# EAGLE schematic MotorDriver (EAGLE 6.5.0)
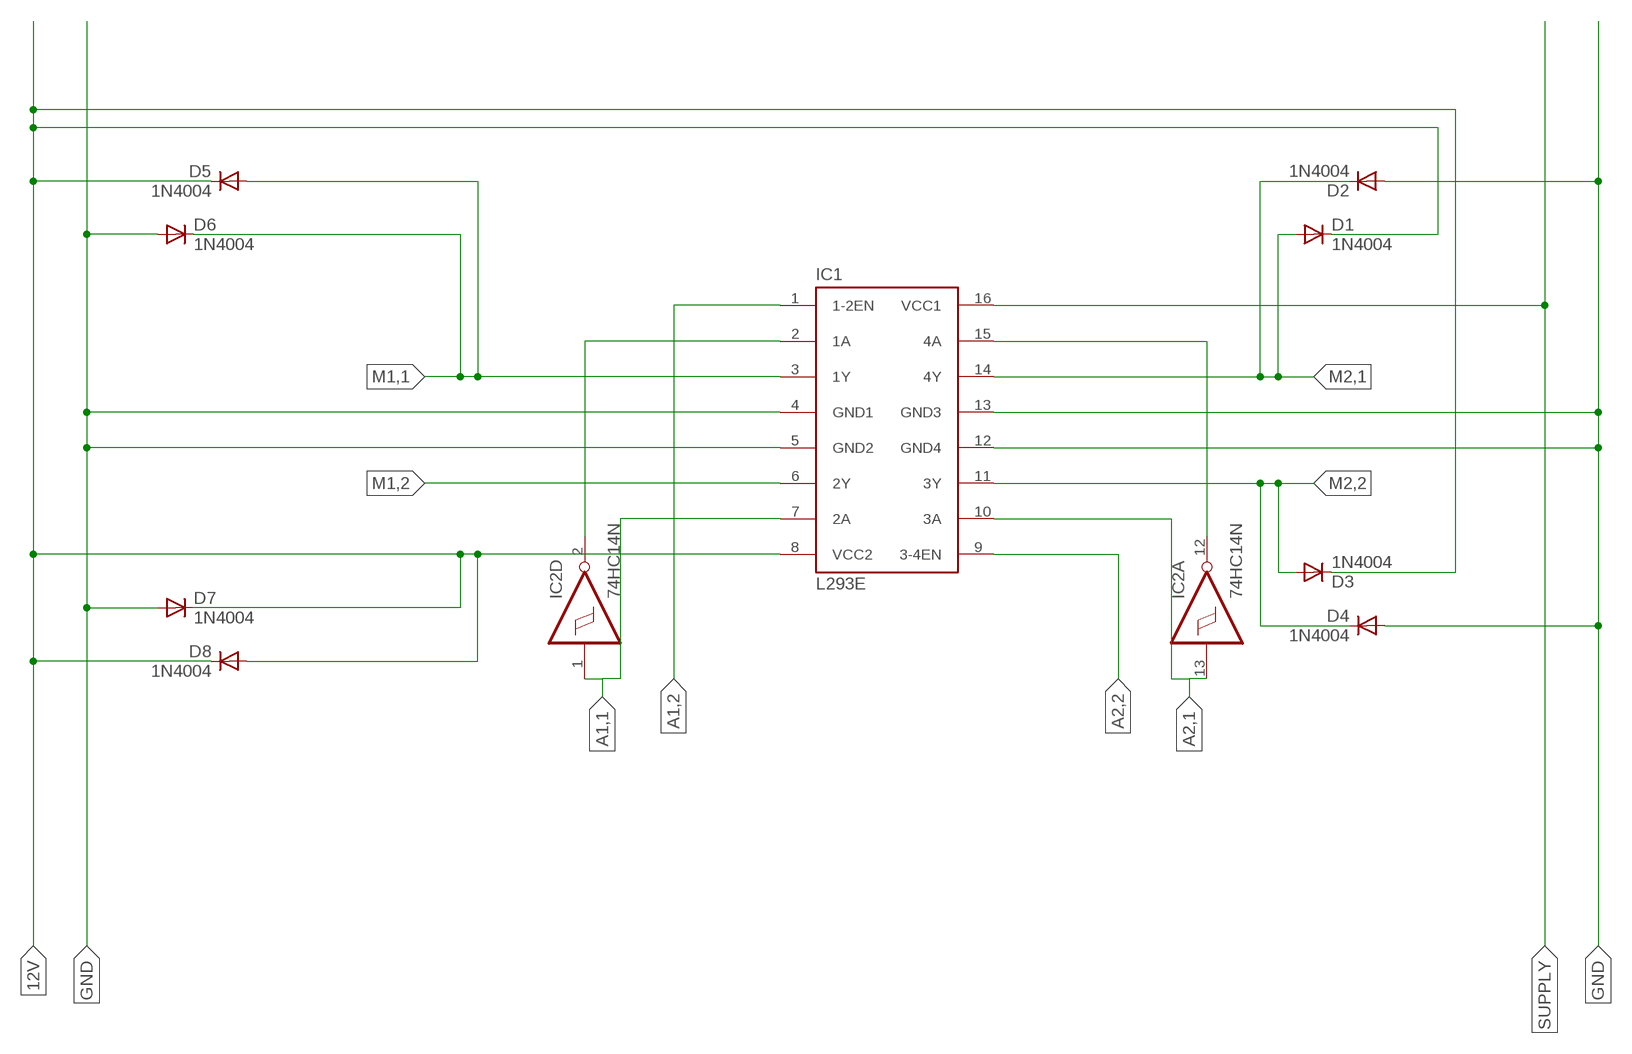
[diagram p0: schematic, sheet 1]

## Parts
D1  1N4004  [DO41-10]
D2  1N4004  [DO41-10]
D3  1N4004  [DO41-10]
D4  1N4004  [DO41-10]
D5  1N4004  [DO41-10]
D6  1N4004  [DO41-10]
D7  1N4004  [DO41-10]
D8  1N4004  [DO41-10]
IC1  L293E  [DIL16]
IC2  74HC14N  [DIL14]

## Nets
5V: IC1.15(4A) IC2.12(A:O)
12V: D1.C D3.C D5.C D7.C D8.A D8.C IC1.8(VCC2)
A1,1: IC1.7(2A) IC2.1(D:I)
A1,2: IC1.1(1-2EN)
A2,1: IC1.10(3A) IC2.13(A:I)
A2,2: IC1.9(3-4EN)
GND: D2.A D4.A D6.A D7.A IC1.4(GND1) IC1.5(GND2) IC1.12(GND4) IC1.13(GND3)
M1,1: D5.A D6.C IC1.3(1Y)
M1,2: IC1.6(2Y)
M2,1: D1.A D2.C IC1.14(4Y)
M2,2: D3.A D4.C IC1.11(3Y)
N$2: IC1.2(1A) IC2.2(D:O)
SUPPLY: IC1.16(VCC1)
Unconnected: IC2.3(E:I) IC2.4(E:O) IC2.5(F:I) IC2.6(F:O) IC2.8(C:O) IC2.9(C:I) IC2.10(B:O) IC2.11(B:I)

## Power pins joined to a net without a drawn wire
GND: IC2.7(P:GND)
VCC: IC2.14(P:VCC)

## Library data of the parts
D1-D8 = diode:1N4004: DIODE general purpose rectifier, 1 A
IC1 = texas:L293E: TI DEVICE; MF: Arrow Electronics; MPN: L293E; OC_FARNELL: 1467711; OC_NEWARK: 89K0732
IC2 = 74xx-eu:74*14: Hex schmitt trigger INVERTER